# Altium schematic sheet [07] - CONNECTOR.SchDoc
size A4; Size: A4; Contact: datasystem.pl
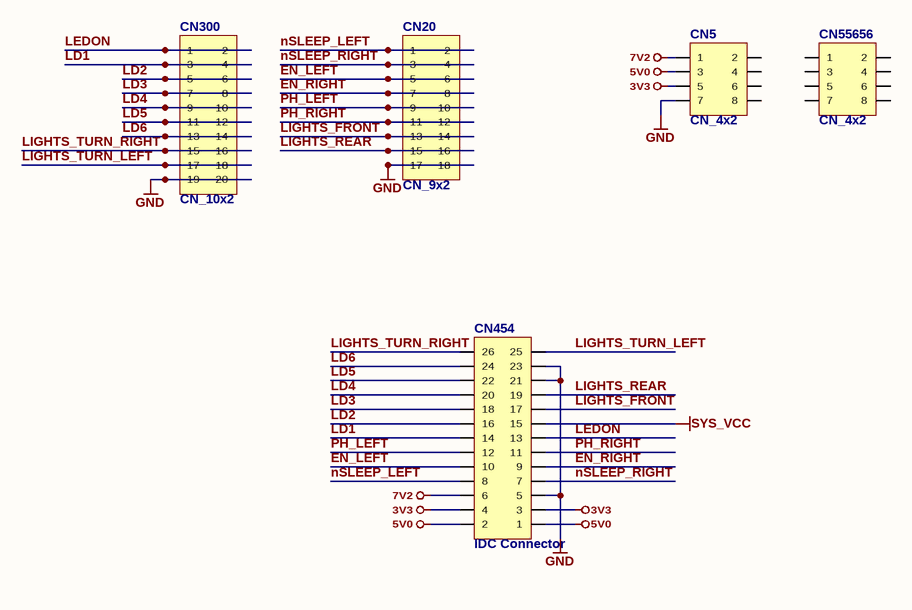
[diagram p0: [07] - CONNECTOR.SchDoc]

## Parts
CN5  CN_4x2  [GP_4x2]
CN20  CN_9x2  [GP_9x2]
CN300  CN_10x2  [GP_10x2]
CN454  IDC Connector  [IDC26_RA]
CN55656  CN_4x2  [GP_4x2]

## Nets
3V3: CN5.5 CN454.3 CN454.4
5V0: CN5.3 CN454.1 CN454.2
7V2: CN5.1 CN454.6
GND: CN5.7 CN20.17 CN20.18 CN300.19 CN300.20 CN454.5 CN454.21 CN454.23
SYS_VCC: CN454.15
EN_LEFT: CN20.5 CN20.6 CN454.10
EN_RIGHT: CN20.7 CN20.8 CN454.9
LD1: CN300.3 CN300.4 CN454.14
LD2: CN300.5 CN300.6 CN454.16
LD3: CN300.7 CN300.8 CN454.18
LD4: CN300.9 CN300.10 CN454.20
LD5: CN300.11 CN300.12 CN454.22
LD6: CN300.13 CN300.14 CN454.24
LEDON: CN300.1 CN300.2 CN454.13
LIGHTS_FRONT: CN20.13 CN20.14 CN454.17
LIGHTS_REAR: CN20.15 CN20.16 CN454.19
LIGHTS_TURN_LEFT: CN300.17 CN300.18 CN454.25
LIGHTS_TURN_RIGHT: CN300.15 CN300.16 CN454.26
nSLEEP_LEFT: CN20.1 CN20.2 CN454.8
nSLEEP_RIGHT: CN20.3 CN20.4 CN454.7
PH_LEFT: CN20.9 CN20.10 CN454.12
PH_RIGHT: CN20.11 CN20.12 CN454.11

Not connected (* = marked no-connect by the designer): CN5 2 4 6 8; CN55656 1 2 3 4 5 6 7 8

## Notes on the sheet
- REV:
- A  P  P  R  O  V  E  D
- /
- Lodz University of Technology
- ul. Wolczanska 211/215
- 90-924 LODZ, POLAND
- Institute of Electronics
- Project name:
- Title:
- Author:
- Verified by:

## Library data of the parts
CN454 = CN_13x2